# Altium project BoostingConverter.PrjPcb
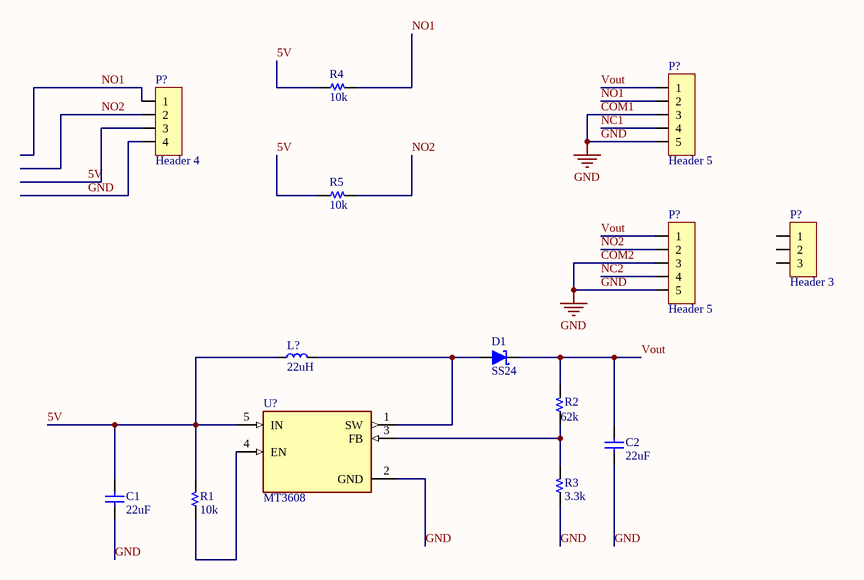
[diagram p0: boostConverter.SchDoc]
1 sheet, 14 parts. Net scope: global (net labels, ports and power ports of the same name join across sheets).
Board file: PCB_BoostingConverter.PcbDoc

## Sheet boostConverter.SchDoc
size A; SheetNumber: 1; SheetTotal: 1

### Parts
(Parts that share a designator on the sheet are numbered #1, #2 ... from top to bottom, then left to right.)
C1  22uF  [C 1210]
C2  22uF  [C 1210]
D1  SS24  [DO-214AC (SMA)]
L?  22uH  [Inductor SMD CDRH3D48]
P?#1  Header 5  [HDR/Terminal/5/RA]
P?#2  Header 4  [HDR/Header/4/2mm/BOX/SMD]
P?#3  Header 5  [HDR/Terminal/5/RA]
P?#4  Header 3  [HDR/Terminal/3/400]
R1  10k  [R 0805]
R2  62k  [R 0805]
R3  3.3k  [R 0805]
R4  10k  [R 0805]
R5  10k  [R 0805]
U?  MT3608  [SOT95P280X145-6N]

### Nets
COM1: C1.2 C2.2 P?#1.3 P?#1.5 P?#2.4 P?#3.3 P?#3.5 R3.1 U?.2(GND)  [also labelled COM2, GND]
5V: C1.1 L?.1 P?#2.3 R1.2 R4.1 R5.1 U?.5(IN)
NC1: P?#1.4
NC2: P?#3.4
NO1: P?#1.2 P?#2.1 R4.2
NO2: P?#2.2 P?#3.2 R5.2
Vout: C2.1 D1.2(K) P?#1.1 P?#3.1 R2.2
NetD1_1: D1.1(A) L?.2 U?.1(SW)
NetR1_1: R1.1 U?.4(EN)
NetR2_1: R2.1 R3.2 U?.3(FB)

Not connected (* = marked no-connect by the designer): P?#4 1 2 3

### Library data of the parts
C1 C2 = Capacitor NP: Capacitor non-pol
D1 = Diode Schottky: Schottky Diode
L? = Inductor
P?#1 P?#3 = Header 5: Header, 5-Pin
P?#2 = Header 4: Header, 4-Pin
P?#4 = Header 3: Header, 3-Pin
R1-R5 = Resistor
U? = MT3608: High Efficiency 1.2MHz2A Step Up Converter; MF: Aerosemi Technology Co., Ltd; Price: None; Availability: Not in stock; Package: Package; MP: MT3608; Value: *; SnapEDA_Link: https://www.snapeda.com/parts/MT3608/Aerosemi+Technology+Co.%252C+Ltd/view-part/?ref=snap; Check_prices: https://www.snapeda.com/parts/MT3608/Aerosemi+Technology+Co.%252C+Ltd/view-part/?ref=eda